# Altium project Nhiet_do_Do_am.PrjPcb
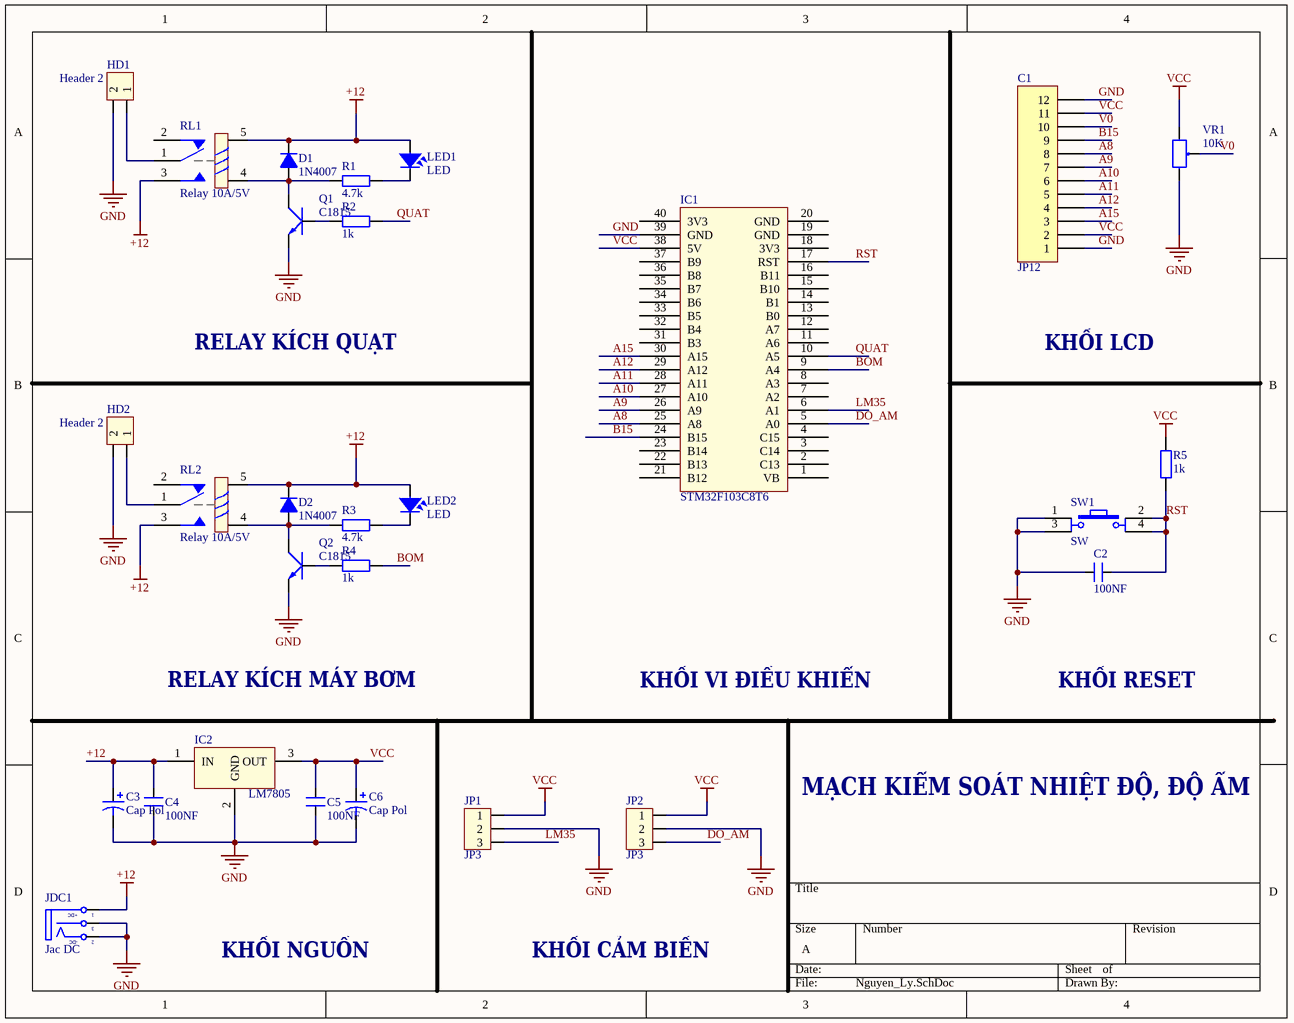
[diagram p0: Nguyen_Ly.SchDoc]
1 sheet, 28 parts. Net scope: global (net labels, ports and power ports of the same name join across sheets).
Board file: Mach_In.PcbDoc

## Sheet Nguyen_Ly.SchDoc
size A; SheetNumber: 1; SheetTotal: 1

### Parts
C1  JP12  [JP12-C1T]
C2  100NF  [CN1]
C3  Cap Pol  [C3MM]
C4  100NF  [CN1]
C5  100NF  [CN1]
C6  Cap Pol  [C3MM]
D1  1N4007  [D1A]
D2  1N4007  [D1A]
HD1  Header 2  [HED2]
HD2  Header 2  [HED2]
IC1  STM32F103C8T6  [DIP40]
IC2  LM7805  [QTO-220]
JDC1  Jac DC  [DC-IN]
JP1  JP3  [CON3]
JP2  JP3  [CON3]
LED1  LED  [LED-3]
LED2  LED  [LED-3]
Q1  C1815  [QTO-92]
Q2  C1815  [QTO-92]
R1  4.7k  [R1/4W]
R2  1k  [R1/4W]
R3  4.7k  [R1/4W]
R4  1k  [R1/4W]
R5  1k  [R1/4W]
RL1  Relay 10A/5V  [RELAY 5]
RL2  Relay 10A/5V  [RELAY 5]
SW1  SW  [SW4]
VR1  10K  [VR]

### Nets
+12: C3.1 C4.2 D1.2(K) D2.2(K) IC2.1(IN) JDC1.1(T) LED1.1 LED2.1 RL1.3 RL1.5 RL2.3 RL2.5
GND: C1.1 C1.12 C2.1 C3.2 C4.1 C5.1 C6.2 HD1.2 HD2.2 IC1.39(GND) IC2.2(GND) JDC1.2(TN) JDC1.3(S) JP1.2 JP2.2 Q1.1(E) Q2.1(E) SW1.1 SW1.3 VR1.3
VCC: C1.2 C1.11 C5.2 C6.1 IC1.38(5V) IC2.3(OUT) JP1.1 JP2.1 R5.2 VR1.1
A8: C1.8 IC1.25(A8)
A9: C1.7 IC1.26(A9)
A10: C1.6 IC1.27(A10)
A11: C1.5 IC1.28(A11)
A12: C1.4 IC1.29(A12)
A15: C1.3 IC1.30(A15)
B15: C1.9 IC1.24(B15)
BOM: IC1.9(A4) R4.2
DO_AM: IC1.5(A0) JP2.3
LM35: IC1.6(A1) JP1.3
QUAT: IC1.10(A5) R2.2
RST: C2.2 IC1.17(RST) R5.1 SW1.2 SW1.4
V0: C1.10 VR1.2
NetD1_1: D1.1(A) Q1.2(C) R1.1 RL1.4
NetD2_1: D2.1(A) Q2.2(C) R3.1 RL2.4
NetHD1_1: HD1.1 RL1.1
NetHD2_1: HD2.1 RL2.1
NetLED1_2: LED1.2 R1.2
NetLED2_2: LED2.2 R3.2
NetQ1_3: Q1.3(B) R2.1
NetQ2_3: Q2.3(B) R4.1

Not connected (* = marked no-connect by the designer): IC1 1(VB) 2(C13) 3(C14) 4(C15) 7(A2) 8(A3) 11(A6) 12(A7) 13(B0) 14(B1) 15(B10) 16(B11) 18(3V3) 19(GND) 20(GND) 21(B12) 22(B13) 23(B14) 31(B3) 32(B4) 33(B5) 34(B6) 35(B7) 36(B8) 37(B9) 40(3V3); RL1 2; RL2 2

### Notes on the sheet
- RELAY KÍCH QUẠT
- KHỐI LCD
- RELAY KÍCH MÁY BƠM
- KHỐI VI ĐIỀU KHIỂN
- KHỐI RESET
- MẠCH KIỂM SOÁT NHIỆT ĐỘ, ĐỘ ẨM
- KHỐI NGUỒN
- KHỐI CẢM BIẾN
- (in symbol DCIN) +DC; -DC

### Library data of the parts
C1 = JP12: WR-PHD 2.54 mm Angled Socket Header; Manufacturer: W¨¹rth Elektronik eiSos GmbH; partNo: 613012143121; ComponentLink1 Description: Manufacturer; ComponentLink2 Description: Datasheet; NoPins: 12; Created Date: 29 March 2013; ComponentLink1URL: http://www.we-online.com; ComponentLink2URL: http://katalog.we-online.de/em/datasheet/6130xx143121.pdf; Created by: Karrer Zheng
C2 C4 C5 = CN1: Cap np  1pF - 472pF; Value: 100pF
C3 C6 = Cap Pol: Polarized Capacitor (Axial); Published: 8-Jun-2000; LatestRevisionDate: 17-Jul-2002; LatestRevisionNote: Re-released for DXP Platform.; PackageReference: POLAR0.8; Publisher: Altium Limited
D1 D2 = D1A: Diode 1A; Value: 1N4007
HD1 HD2 = Hed2: Header 2 (Green); Value: Header 2
IC1 = STM32F103C8T6_GREEN
IC2 = LM78xx: On ap +, from + 5 to + 24VDC; Value: LM7805
JDC1 = DCIN: Jac DC input; Value: Jac DC
JP1 JP2 = Con3: Connector 3; Value: Connector 3
LED1 LED2 = LED: LED Single colour Green and Red; Value: LED 3 ly Single Colour
Q1 Q2 = C1815: NPN 600mW, ECB; Value: C1815
R1-R5 = R1/4W: Resistor 1/4W; Value: R1/4W - 1K
RL1 RL2 = Relay 5: Relay SPDT,10A - 12VDC 5 Pin; Value: Relay SPDT, 10A, 12V
SW1 = SW4: Switch button 4 pin; Value: Button chip 4 pin
VR1 = VR: Var Resistor; Value: VR 10K